# Altium schematic sheet SCH-HC15C_REV2_PG2.SchDoc: MODEL: HC 15C
size 863 x 558 mm; DocumentNumber: SCH-HC15C; SheetNumber: 2; SheetTotal: 3; Title2: HAB'S 1ST GEN CALCULATOR
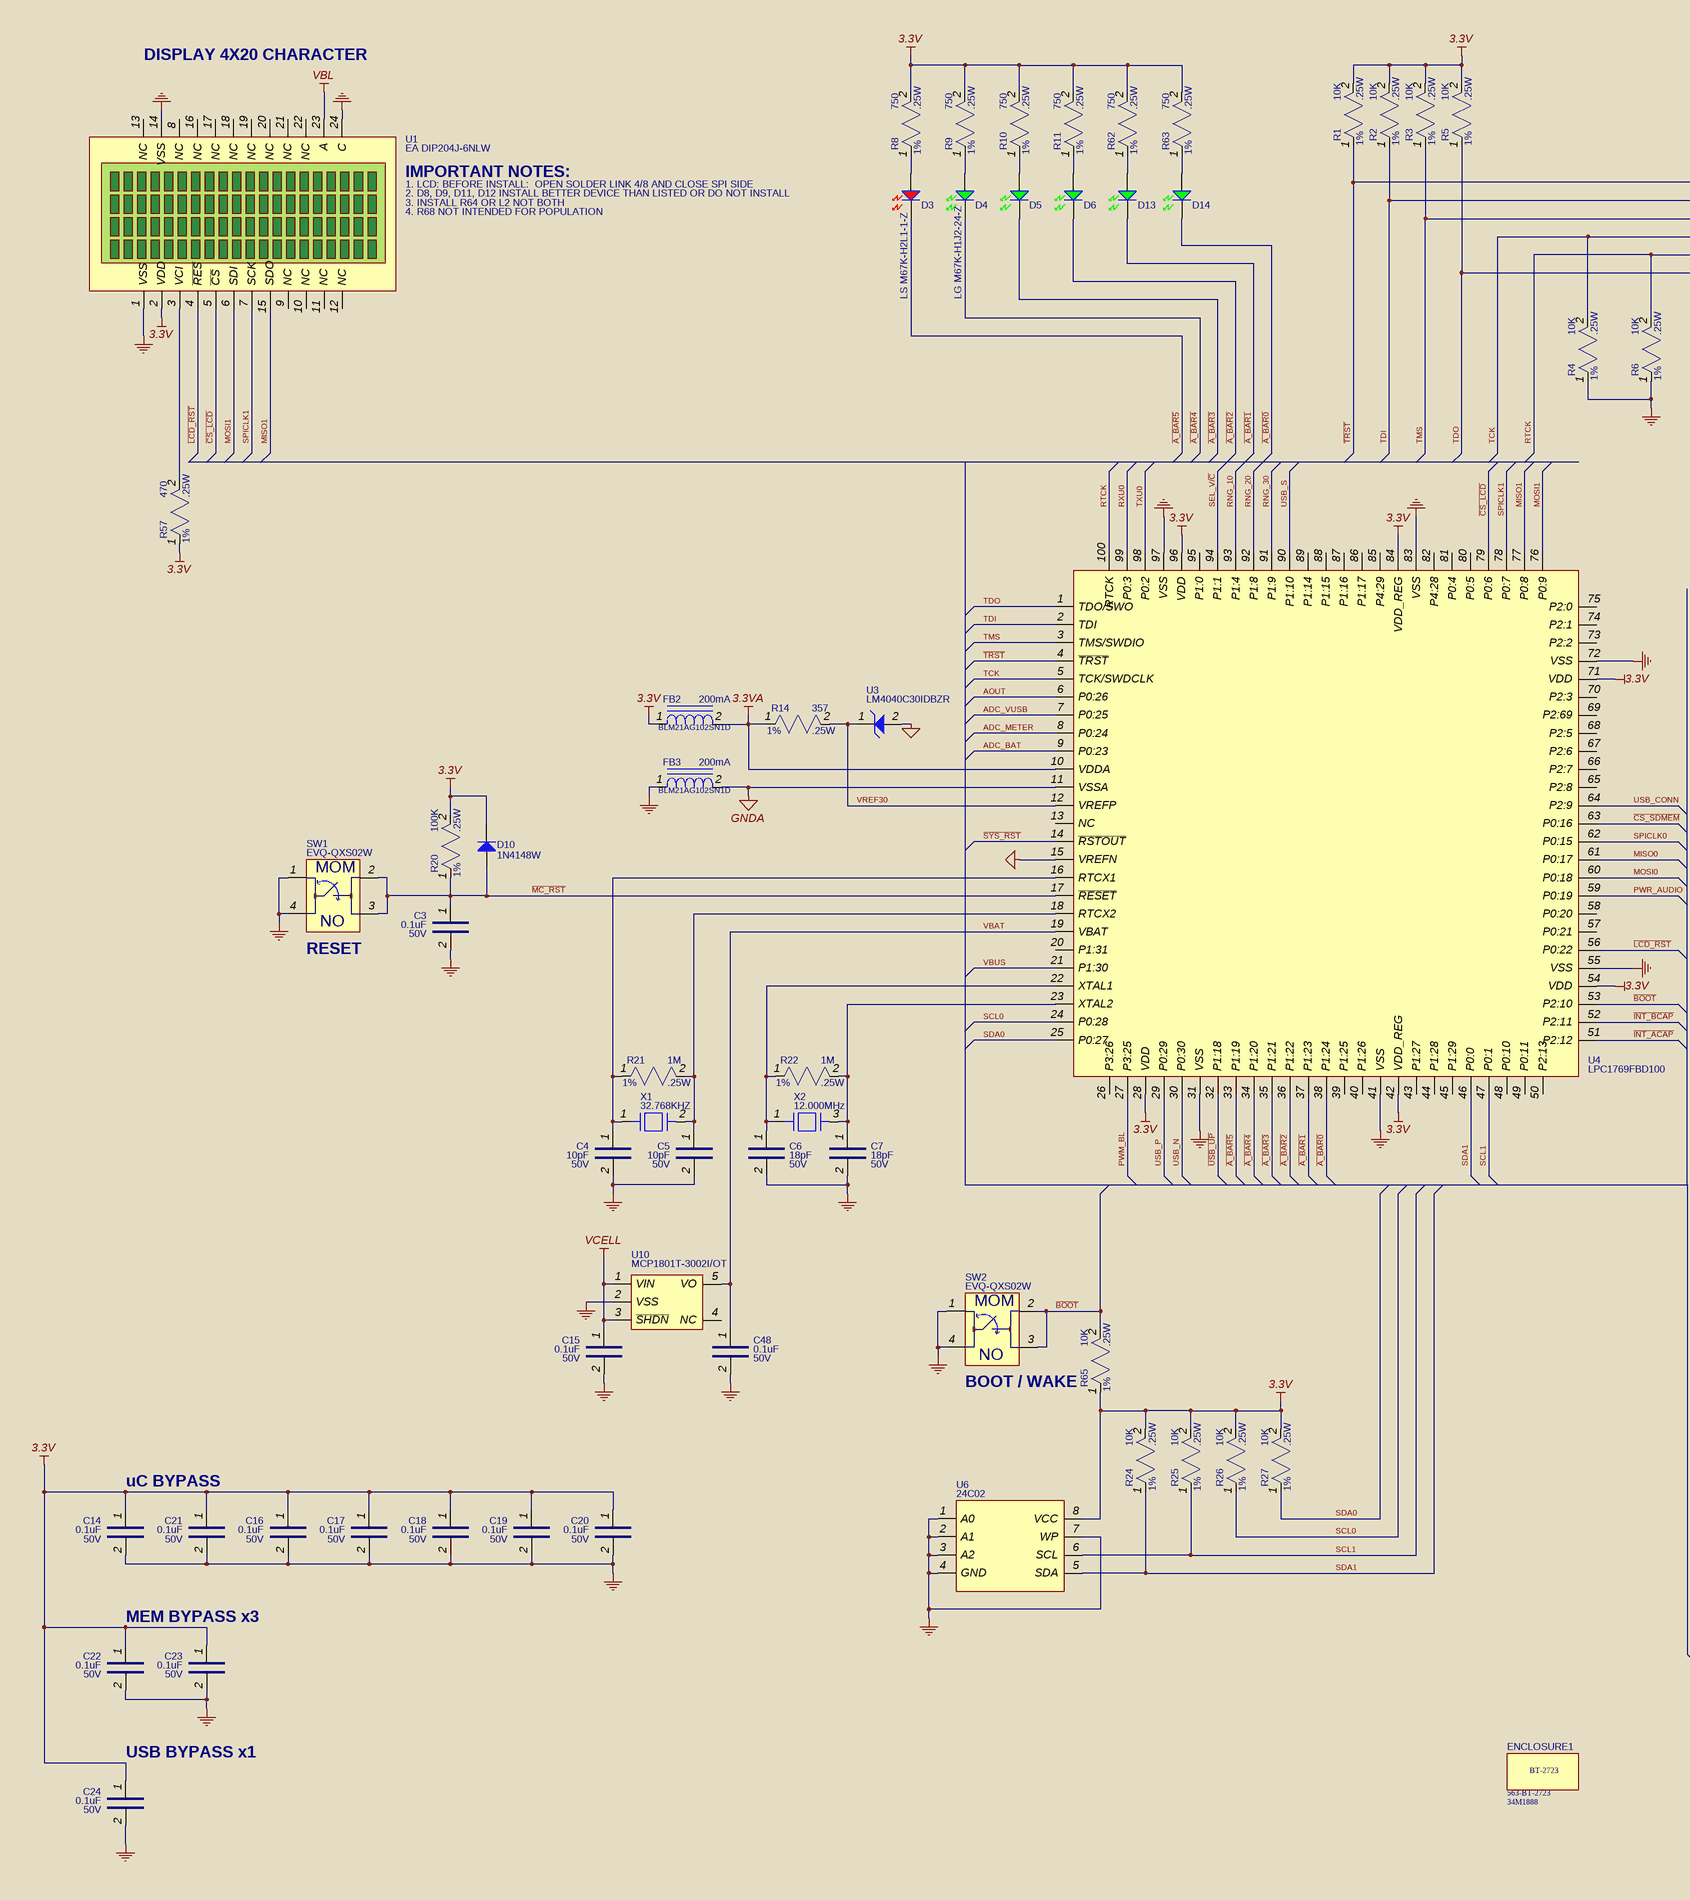
[diagram p0: SCH-HC15C_REV2_PG2.SchDoc, left]
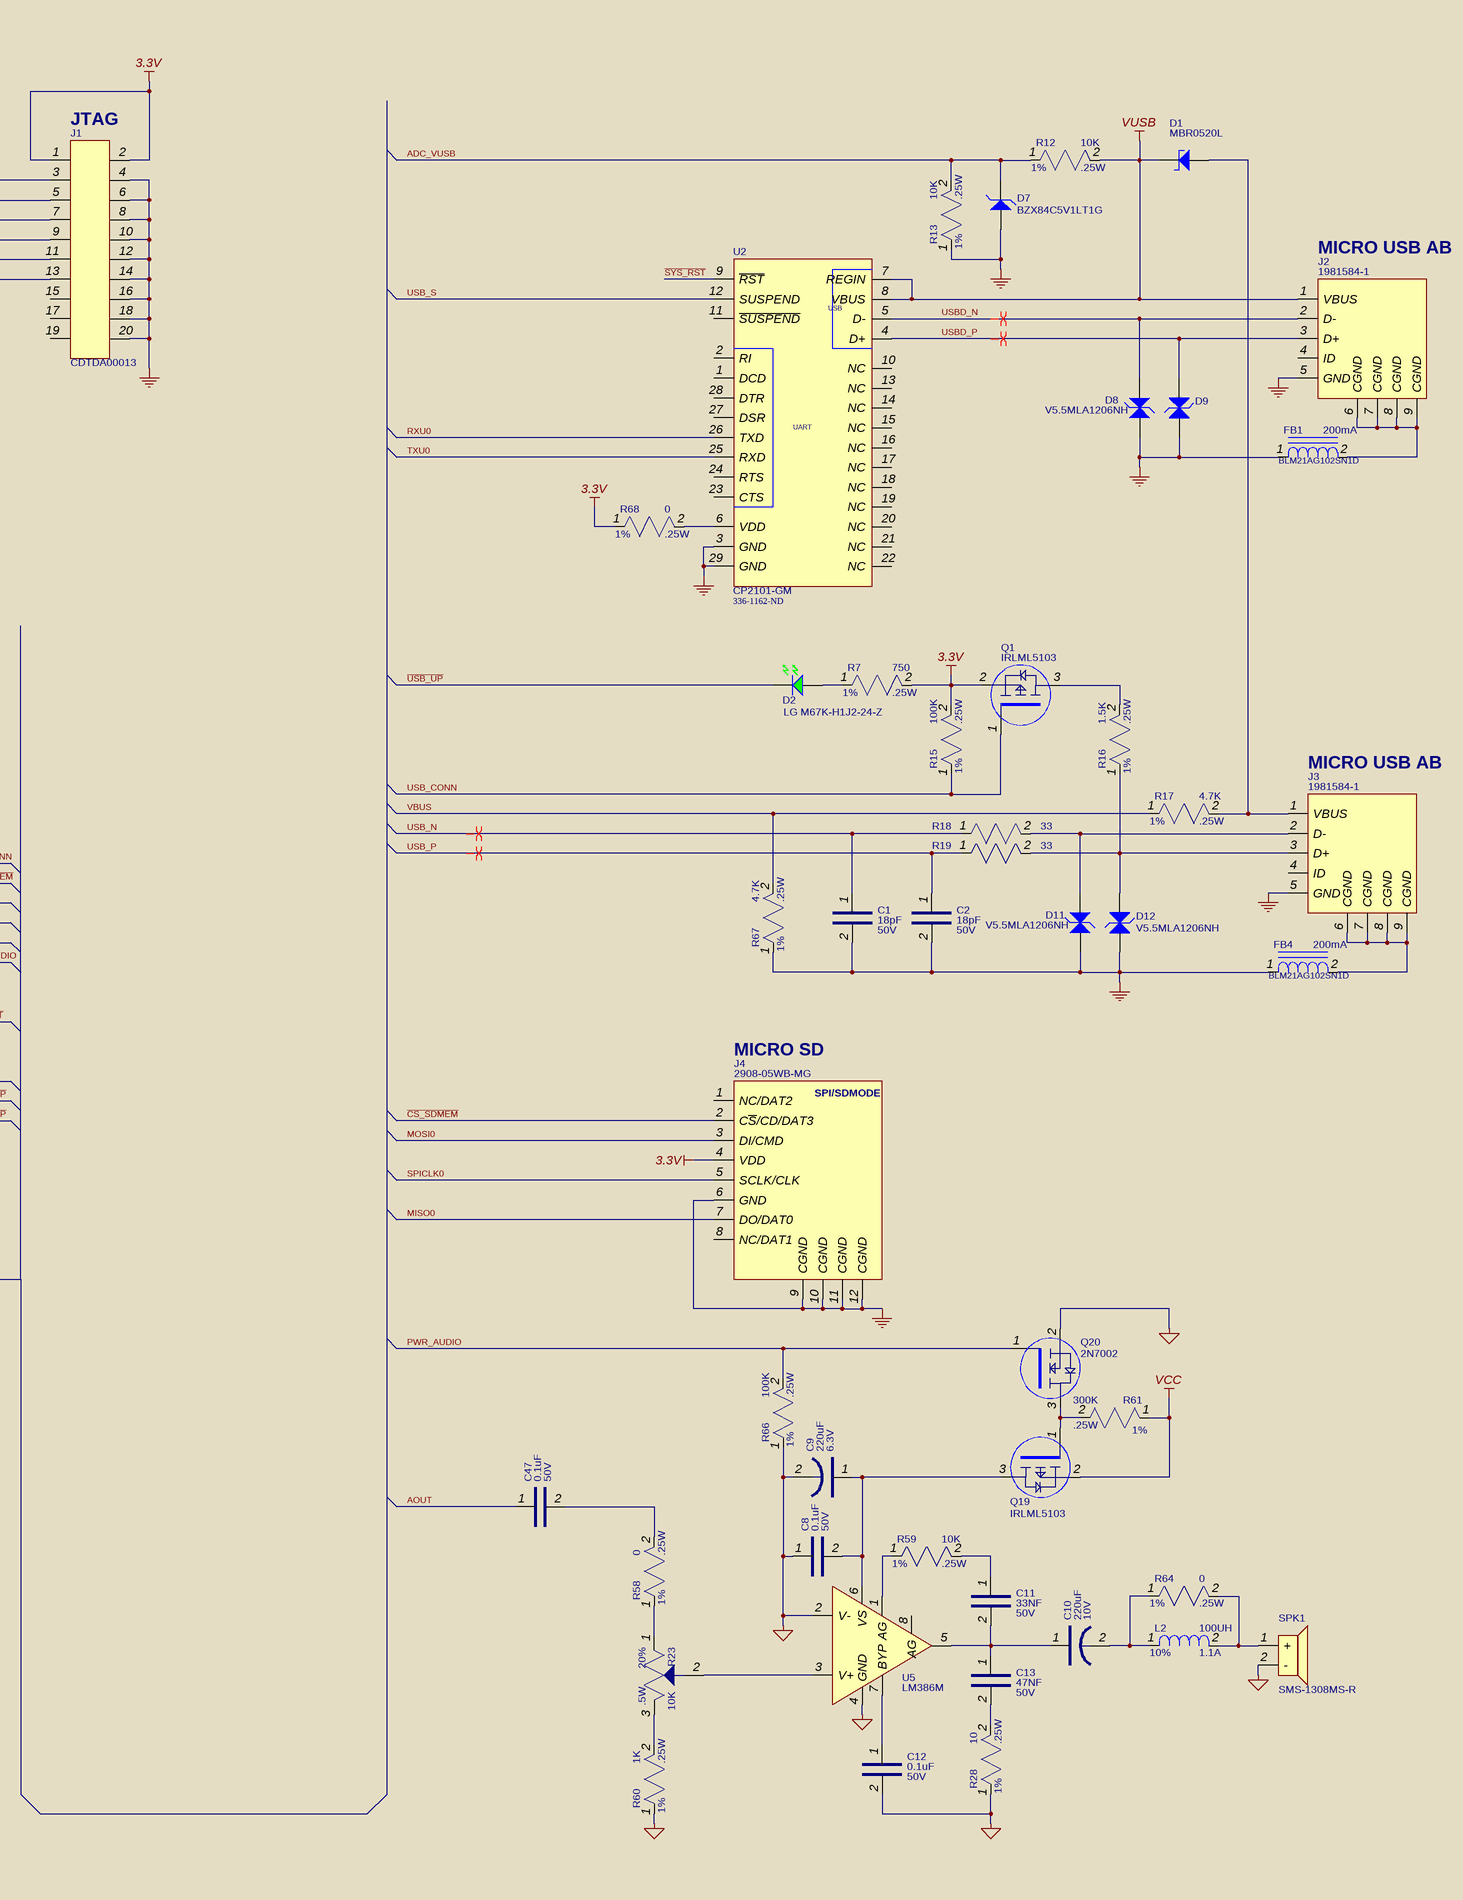
[diagram p1: SCH-HC15C_REV2_PG2.SchDoc, right]

## Parts
C1  value 18pF  VOLTAGE: 50V  [3216[1206] - TAN COLOR]  (hidden comment: CDECA00095)
C2  value 18pF  VOLTAGE: 50V  [3216[1206] - TAN COLOR]  (hidden comment: CDECA00095)
C3  value 0.1uF  VOLTAGE: 50V  [3216[1206] - TAN COLOR]  (hidden comment: CDECA00070)
C4  value 10pF  VOLTAGE: 50V  [3216[1206] - TAN COLOR]  (hidden comment: CDECA00143)
C5  value 10pF  VOLTAGE: 50V  [3216[1206] - TAN COLOR]  (hidden comment: CDECA00143)
C6  value 18pF  VOLTAGE: 50V  [3216[1206] - TAN COLOR]  (hidden comment: CDECA00095)
C7  value 18pF  VOLTAGE: 50V  [3216[1206] - TAN COLOR]  (hidden comment: CDECA00095)
C8  value 0.1uF  VOLTAGE: 50V  [3216[1206] - TAN COLOR]  (hidden comment: CDECA00070)
C9  value 220uF  VOLTAGE: 6.3V  [CAP_TANT_3528]  (hidden comment: CDECA00139_2)
C10  value 220uF  VOLTAGE: 10V  [CAP_ALE_WX-8mm]  (hidden comment: CDECA00110_2)
C11  value 33NF  VOLTAGE: 50V  [3216[1206] - TAN COLOR]  (hidden comment: CDECA00143_3)
C12  value 0.1uF  VOLTAGE: 50V  [3216[1206] - TAN COLOR]  (hidden comment: CDECA00070)
C13  value 47NF  VOLTAGE: 50V  [3216[1206] - TAN COLOR]  (hidden comment: CDECA00143_2)
C14  value 0.1uF  VOLTAGE: 50V  [3216[1206] - TAN COLOR]  (hidden comment: CDECA00070)
C15  value 0.1uF  VOLTAGE: 50V  [3216[1206] - TAN COLOR]  (hidden comment: CDECA00070)
C16  value 0.1uF  VOLTAGE: 50V  [3216[1206] - TAN COLOR]  (hidden comment: CDECA00070)
C17  value 0.1uF  VOLTAGE: 50V  [3216[1206] - TAN COLOR]  (hidden comment: CDECA00070)
C18  value 0.1uF  VOLTAGE: 50V  [3216[1206] - TAN COLOR]  (hidden comment: CDECA00070)
C19  value 0.1uF  VOLTAGE: 50V  [3216[1206] - TAN COLOR]  (hidden comment: CDECA00070)
C20  value 0.1uF  VOLTAGE: 50V  [3216[1206] - TAN COLOR]  (hidden comment: CDECA00070)
C21  value 0.1uF  VOLTAGE: 50V  [3216[1206] - TAN COLOR]  (hidden comment: CDECA00070)
C22  value 0.1uF  VOLTAGE: 50V  [3216[1206] - TAN COLOR]  (hidden comment: CDECA00070)
C23  value 0.1uF  VOLTAGE: 50V  [3216[1206] - TAN COLOR]  (hidden comment: CDECA00070)
C24  value 0.1uF  VOLTAGE: 50V  [3216[1206] - TAN COLOR]  (hidden comment: CDECA00070)
C47  value 0.1uF  VOLTAGE: 50V  [3216[1206] - TAN COLOR]  (hidden comment: CDECA00070)
C48  value 0.1uF  VOLTAGE: 50V  [3216[1206] - TAN COLOR]  (hidden comment: CDECA00070)
D1  value MBR0520L  [SOD123]  (hidden comment: CDEDA00019_1)
D2  value LG M67K-H1J2-24-Z  [OSRAM_XX_M67K]  (hidden comment: CDELA00016_1)
D3  value LS M67K-H2L1-1-Z  [OSRAM_XX_M67K]  (hidden comment: CDELA00015_1)
D4  value LG M67K-H1J2-24-Z  [OSRAM_XX_M67K]  (hidden comment: CDELA00016_1)
D5  CDELA00016_1  [OSRAM_XX_M67K]  (value not drawn)
D6  CDELA00016_1  [OSRAM_XX_M67K]  (value not drawn)
D7  value BZX84C5V1LT1G  [SOT23 - TRANSISTOR]  (hidden comment: CDEDA00043)
D8  value V5.5MLA1206NH  [3216[1206]]  (hidden comment: CDEDA00037_1)
D9  CDEDA00037_1  [3216[1206]]  (value not drawn)
D10  value 1N4148W  [SOD123]  (hidden comment: CDEDA00020)
D11  value V5.5MLA1206NH  [3216[1206]]  (hidden comment: CDEDA00037_1)
D12  value V5.5MLA1206NH  [3216[1206]]  (hidden comment: CDEDA00037_1)
D13  CDELA00016_1  [OSRAM_XX_M67K]  (value not drawn)
D14  CDELA00016_1  [OSRAM_XX_M67K]  (value not drawn)
ENCLOSURE1  Supplier Part Number 1: 563-BT-2723  Supplier Part Number 2: 34M1888  [BT-2723]  (hidden comment: CDEVA_3)  (no BOM)
FB1  MFG_PN: BLM21AG102SN1D  POWER: 200mA  [2012[0805]]  (hidden comment: CDEVA00115)
FB2  MFG_PN: BLM21AG102SN1D  POWER: 200mA  [2012[0805]]  (hidden comment: CDEVA00115)
FB3  MFG_PN: BLM21AG102SN1D  POWER: 200mA  [2012[0805]]  (hidden comment: CDEVA00115)
FB4  MFG_PN: BLM21AG102SN1D  POWER: 200mA  [2012[0805]]  (hidden comment: CDEVA00115)
J1  CDTDA00013  [HDR_2X10_100MIL]
J2  value 1981584-1  [TYCO_1981584-1_REV2]  (hidden comment: CDTDA_1)
J3  value 1981584-1  [TYCO_1981584-1_REV2]  (hidden comment: CDTDA_1)
J4  value 2908-05WB-MG  [3M_2908-05WB-MG]  (hidden comment: CDTDA_2)
L2  value 100UH  TOLERANCE: 10%  POWER: 1.1A  [BOURNS_SDR0805-XXXX]  (hidden comment: CDEHA00005_2)
Q1  value IRLML5103  [SOT23 - TRANSISTOR]  (hidden comment: CDENA00031)
Q19  value IRLML5103  [SOT23 - TRANSISTOR]  (hidden comment: CDENA00031)
Q20  value 2N7002  [SOT23 - TRANSISTOR]  (hidden comment: CDENA00030)
R1  value 10K  TOLERANCE: 1%  POWER: .25W  [3216[1206]]  (hidden comment: CDERA00170)
R2  value 10K  TOLERANCE: 1%  POWER: .25W  [3216[1206]]  (hidden comment: CDERA00170)
R3  value 10K  TOLERANCE: 1%  POWER: .25W  [3216[1206]]  (hidden comment: CDERA00170)
R4  value 10K  TOLERANCE: 1%  POWER: .25W  [3216[1206]]  (hidden comment: CDERA00170)
R5  value 10K  TOLERANCE: 1%  POWER: .25W  [3216[1206]]  (hidden comment: CDERA00170)
R6  value 10K  TOLERANCE: 1%  POWER: .25W  [3216[1206]]  (hidden comment: CDERA00170)
R7  value 750  TOLERANCE: 1%  POWER: .25W  [3216[1206]]  (hidden comment: CDERA00276_1)
R8  value 750  TOLERANCE: 1%  POWER: .25W  [3216[1206]]  (hidden comment: CDERA00276_1)
R9  value 750  TOLERANCE: 1%  POWER: .25W  [3216[1206]]  (hidden comment: CDERA00276_1)
R10  value 750  TOLERANCE: 1%  POWER: .25W  [3216[1206]]  (hidden comment: CDERA00276_1)
R11  value 750  TOLERANCE: 1%  POWER: .25W  [3216[1206]]  (hidden comment: CDERA00276_1)
R12  value 10K  TOLERANCE: 1%  POWER: .25W  [3216[1206]]  (hidden comment: CDERA00170)
R13  value 10K  TOLERANCE: 1%  POWER: .25W  [3216[1206]]  (hidden comment: CDERA00170)
R14  value 357  TOLERANCE: 1%  POWER: .25W  [3216[1206]]  (hidden comment: CDERA00275_6)
R15  value 100K  TOLERANCE: 1%  POWER: .25W  [3216[1206]]  (hidden comment: CDERA00198)
R16  value 1.5K  TOLERANCE: 1%  POWER: .25W  [3216[1206]]  (hidden comment: CDERA00179)
R17  value 4.7K  TOLERANCE: 1%  POWER: .25W  [3216[1206]]  (hidden comment: CDERA00169)
R18  value 33  [3216[1206]]  (hidden comment: CDERA00207)
R19  value 33  [3216[1206]]  (hidden comment: CDERA00207)
R20  value 100K  TOLERANCE: 1%  POWER: .25W  [3216[1206]]  (hidden comment: CDERA00198)
R21  value 1M  TOLERANCE: 1%  POWER: .25W  [3216[1206]]  (hidden comment: CDERA00191)
R22  value 1M  TOLERANCE: 1%  POWER: .25W  [3216[1206]]  (hidden comment: CDERA00191)
R23  value 10K  TOLERANCE: 20%  POWER: .5W  [BOURNS_3352]  (hidden comment: CDERA00207_2)
R24  value 10K  TOLERANCE: 1%  POWER: .25W  [3216[1206]]  (hidden comment: CDERA00170)
R25  value 10K  TOLERANCE: 1%  POWER: .25W  [3216[1206]]  (hidden comment: CDERA00170)
R26  value 10K  TOLERANCE: 1%  POWER: .25W  [3216[1206]]  (hidden comment: CDERA00170)
R27  value 10K  TOLERANCE: 1%  POWER: .25W  [3216[1206]]  (hidden comment: CDERA00170)
R28  value 10  TOLERANCE: 1%  POWER: .25W  [3216[1206]]  (hidden comment: CDERA00142)
R57  value 470  TOLERANCE: 1%  POWER: .25W  [3216[1206]]  (hidden comment: CDERA00153)
R58  value 0  TOLERANCE: 1%  POWER: .25W  [3216[1206]]  (hidden comment: CDERA00181)
R59  value 10K  TOLERANCE: 1%  POWER: .25W  [3216[1206]]  (hidden comment: CDERA00170)
R60  value 1K  TOLERANCE: 1%  POWER: .25W  [3216[1206]]  (hidden comment: CDERA00195)
R61  value 300K  TOLERANCE: 1%  POWER: .25W  [3216[1206]]  (hidden comment: CDERA00275_8)
R62  value 750  TOLERANCE: 1%  POWER: .25W  [3216[1206]]  (hidden comment: CDERA00276_1)
R63  value 750  TOLERANCE: 1%  POWER: .25W  [3216[1206]]  (hidden comment: CDERA00276_1)
R64  value 0  TOLERANCE: 1%  POWER: .25W  [3216[1206]]  (hidden comment: CDERA00181)
R65  value 10K  TOLERANCE: 1%  POWER: .25W  [3216[1206]]  (hidden comment: CDERA00170)
R66  value 100K  TOLERANCE: 1%  POWER: .25W  [3216[1206]]  (hidden comment: CDERA00198)
R67  value 4.7K  TOLERANCE: 1%  POWER: .25W  [3216[1206]]  (hidden comment: CDERA00169)
R68  value 0  TOLERANCE: 1%  POWER: .25W  [3216[1206]]  (hidden comment: CDERA00181)
SPK1  MFG_PN: SMS-1308MS-R  [PUI_AUDIO_SMS-1308MS-R]  (hidden comment: CDEVA_2)
SW1  value EVQ-QXS02W  [PANASONIC_EVQQX]  (hidden comment: CDESA00095)
SW2  value EVQ-QXS02W  [PANASONIC_EVQQX]  (hidden comment: CDESA00095)
U1  value EA DIP204J-6NLW  [EA_790-EADIP204J6NLW]  (hidden comment: CDELA00023_1)
U2  value CP2101-GM  Supplier Part Number 1: 336-1162-ND  [QFN50P500X500-28VBM-MODIFIED]  (hidden comment: CDEUA00070_1)
U3  value LM4040C30IDBZR  [SOT23 - TRANSISTOR]  (hidden comment: CDEUA00049)
U4  MFG_PN: LPC1769FBD100  [SQFP50P1600X1600-100M_MODIFIED]  (hidden comment: CDEUA00069_2)
U5  value LM386M  [S8_N: Linear Tech SO8 NARROW]  (hidden comment: CDEUA00071_1)
U6  value 24C02  [S8_N: Linear Tech SO8 NARROW]  (hidden comment: CDEUA00020)
U10  value MCP1801T-3002I/OT  [SOT23-5AN]  (hidden comment: CDEUA00071_2)
X1  value 32.768KHZ  [ABS10]  (hidden comment: CDEKA00015_1)
X2  value 12.000MHz  [TCX_7B]  (hidden comment: CDEKA00019_1)

## Nets
3.3V: C14.1 C16.1 C17.1 C18.1 C19.1 C20.1 C21.1 C22.1 C23.1 C24.1 D10.2(K) FB2.1 J1.1 J1.2 J4.4(VDD) Q1.2(E) R1.2 R2.2 R3.2 R5.2 R7.2 R8.2 R9.2 R10.2 R11.2 R15.2 R20.2 R24.2 R25.2 R26.2 R27.2 R57.1 R62.2 R63.2 R65.1 R68.1 U1.2(VDD) U4.28(VDD) U4.42(VDD_REG) U4.54(VDD) U4.71(VDD) U4.84(VDD_REG) U4.96(VDD) U6.8(VCC)
3.3VA: FB2.2 R14.1 U4.10(VDDA)
GND: C1.2 C2.2 C3.2 C4.2 C5.2 C6.2 C7.2 C14.2 C15.2 C16.2 C17.2 C18.2 C19.2 C20.2 C21.2 C22.2 C23.2 C24.2 C48.2 D7.1(A) D8.1(A) D9.1(A) D11.1(A) D12.1(A) FB1.1 FB3.1 FB4.1 J1.4 J1.6 J1.8 J1.10 J1.12 J1.14 J1.16 J1.18 J1.20 J2.5(GND) J3.5(GND) J4.6(GND) J4.9(CGND) J4.10(CGND) J4.11(CGND) J4.12(CGND) R4.1 R6.1 R13.1 R67.1 SW1.1 SW1.4 SW2.1 SW2.4 U1.1(VSS) U1.14(VSS) U1.24(C) U2.3(GND) U2.29(GND) U4.31(VSS) U4.41(VSS) U4.55(VSS) U4.72(VSS) U4.83(VSS) U4.97(VSS) U6.1(A0) U6.2(A1) U6.3(A2) U6.4(GND) U6.7(WP) U10.2(VSS) X2.2 X2.4
GNDA: C8.1 C9.2 C12.2 FB3.2 Q20.2(E) R28.1 R60.1 R66.1 SPK1.2(-) U3.2(A) U4.11(VSSA) U4.15(VREFN) U5.2(V-) U5.4(GND)
VBL: U1.23(A)
VCC: Q19.2(E) R61.1
VCELL: C15.1 U10.1(VIN) U10.3(~{SHDN})
VUSB: D1.2(K) J2.1(VBUS) R12.2 U2.7(REGIN) U2.8(VBUS)
~{A_BAR0}: D14.2(K) U4.38(P1:24)
~{A_BAR1}: D13.2(K) U4.37(P1:23)
~{A_BAR2}: D6.2(K) U4.36(P1:22)
~{A_BAR3}: D5.2(K) U4.35(P1:21)
~{A_BAR4}: D4.2(K) U4.34(P1:20)
~{A_BAR5}: D3.2(K) U4.33(P1:19)
~{BOOT}: R65.2 SW2.2 SW2.3 U4.53(P2:10)
~{CS_LCD}: U1.5(~{CS}) U4.79(P0:6)
~{CS_SDMEM}: J4.2(C~{S}/CD/DAT3) U4.63(P0:16)
~{INT_ACAP}: U4.51(P2:12)
~{INT_BCAP}: U4.52(P2:11)
~{LCD_RST}: U1.4(~{RES}) U4.56(P0:22)
~{MC_RST}: C3.1 D10.1(A) R20.1 SW1.2 SW1.3 U4.17(~{RESET})
~{SYS_RST}: U2.9(~{RST}) U4.14(~{RSTOUT})
~{TRST}: J1.3 R1.1 U4.4(~{TRST})
~{USB_UP}: D2.2(K) U4.32(P1:18)
ADC_BAT: U4.9(P0:23)
ADC_METER: U4.8(P0:24)
ADC_VUSB: D7.3(K) R12.1 R13.2 U4.7(P0:25)
AOUT: C47.1 U4.6(P0:26)
MISO0: J4.7(DO/DAT0) U4.61(P0:17)
MISO1: U1.15(SDO) U4.77(P0:8)
MOSI0: J4.3(DI/CMD) U4.60(P0:18)
MOSI1: U1.6(SDI) U4.76(P0:9)
PWM_BL: U4.27(P3:25)
PWR_AUDIO: Q20.1(B) R66.2 U4.59(P0:19)
RNG_10: U4.93(P1:4)
RNG_20: U4.92(P1:8)
RNG_30: U4.91(P1:9)
RTCK: J1.11 R6.2 U4.100(RTCK)
RXU0: U2.26(TXD) U4.99(P0:3)
SCL0: R26.1 U4.24(P0:28)
SCL1: R25.1 U4.47(P0:1) U6.6(SCL)
SDA0: R27.1 U4.25(P0:27)
SDA1: R24.1 U4.46(P0:0) U6.5(SDA)
SEL_V/~{C}: U4.94(P1:1)
SPICLK0: J4.5(SCLK/CLK) U4.62(P0:15)
SPICLK1: U1.7(SCK) U4.78(P0:7)
TCK: J1.9 R4.2 U4.5(TCK/SWDCLK)
TDI: J1.5 R2.1 U4.2(TDI)
TDO: J1.13 R5.1 U4.1(TDO/SWO)
TMS: J1.7 R3.1 U4.3(TMS/SWDIO)
TXU0: U2.25(RXD) U4.98(P0:2)
USB_CONN: Q1.1(B) R15.1 U4.64(P2:9)
USB_N: C1.1 R18.1 U4.30(P0:30)
USB_P: C2.1 R19.1 U4.29(P0:29)
USB_S: U2.12(SUSPEND) U4.90(P1:10)
USBD_N: D8.2(K) J2.2(D-) U2.5(D-)
USBD_P: D9.2(K) J2.3(D+) U2.4(D+)
VBAT: C48.1 U4.19(VBAT) U10.5(VO)
VBUS: R17.1 R67.2 U4.21(P1:30)
VREF30: R14.2 U3.1(K) U4.12(VREFP)
NetC4_1: C4.1 R21.1 U4.16(RTCX1) X1.1
NetC5_1: C5.1 R21.2 U4.18(RTCX2) X1.2
NetC6_1: C6.1 R22.1 U4.22(XTAL1) X2.1
NetC7_1: C7.1 R22.2 U4.23(XTAL2) X2.3
NetC8_2: C8.2 C9.1 Q19.3(C) U5.6(VS)
NetC10_1: C10.1 C11.2 C13.1 U5.5
NetC10_2: C10.2 L2.1 R64.1
NetC11_1: C11.1 R59.2
NetC12_1: C12.1 U5.7(BYP)
NetC13_2: C13.2 R28.2
NetC47_2: C47.2 R58.2
NetD1_1: D1.1(A) J3.1(VBUS) R17.2
NetD2_1: D2.1(A) R7.1
NetD3_1: D3.1(A) R8.1
NetD4_1: D4.1(A) R9.1
NetD5_1: D5.1(A) R10.1
NetD6_1: D6.1(A) R11.1
NetD11_2: D11.2(K) J3.2(D-) R18.2
NetD12_2: D12.2(K) J3.3(D+) R16.1 R19.2
NetD13_1: D13.1(A) R62.1
NetD14_1: D14.1(A) R63.1
NetFB1_2: FB1.2 J2.6(CGND) J2.7(CGND) J2.8(CGND) J2.9(CGND)
NetFB4_2: FB4.2 J3.6(CGND) J3.7(CGND) J3.8(CGND) J3.9(CGND)
NetL2_2: L2.2 R64.2 SPK1.1(+)
NetQ1_3: Q1.3(C) R16.2
NetQ19_1: Q19.1(B) Q20.3(C) R61.2
NetR23_1: R23.1 R58.1
NetR23_2: R23.2 U5.3(V+)
NetR23_3: R23.3 R60.2
NetR57_2: R57.2 U1.3(VCI)
NetR59_1: R59.1 U5.1(AG)
NetR68_2: R68.2 U2.6(VDD)

Not connected (* = marked no-connect by the designer): J1 15 17 19; J2 4(ID); J3 4(ID); J4 1(NC/DAT2) 8(NC/DAT1); U1 8(NC) 9(NC) 10(NC) 11(NC) 12(NC) 13(NC) 16(NC) 17(NC) 18(NC) 19(NC) 20(NC) 21(NC) 22(NC); U2 1(DCD) 2(RI) 10(NC) 11(~{SUSPEND}) 13(NC) 14(NC) 15(NC) 16(NC) 17(NC) 18(NC) 19(NC) 20(NC) 21(NC) 22(NC) 23(CTS) 24(RTS) 27(DSR) 28(DTR); U4 13(NC) 20(P1:31) 26(P3:26) 39(P1:25) 40(P1:26) 43(P1:27) 44(P1:28) 45(P1:29) 48(P0:10) 49(P0:11) 50(P2:13) 57(P0:21) 58(P0:20) 65(P2:8) 66(P2:7) 67(P2:6) 68(P2:5) 69(P2:69) 70(P2:3) 73(P2:2) 74(P2:1) 75(P2:0) 80(P0:5) 81(P0:4) 82(P4:28) 85(P4:29) 86(P1:17) 87(P1:16) 88(P1:15) 89(P1:14) 95(P1:0); U5 8(AG); U10 4(NC)

## Layout directives
differential pair: USB_N, USB_P, USBD_N, USBD_P

## Notes on the sheet
- DISPLAY 4X20 CHARACTER
- (near J1) JTAG
- IMPORTANT NOTES:
- 1. LCD: BEFORE INSTALL:  OPEN SOLDER LINK 4/8 AND CLOSE SPI SIDE
- 2. D8, D9, D11, D12 INSTALL BETTER DEVICE THAN LISTED OR DO NOT INSTALL
- 3. INSTALL R64 OR L2 NOT BOTH
- 4. R68 NOT INTENDED FOR POPULATION
- MICRO USB AB
- (near SW1) RESET
- MICRO SD
- (near SW2) BOOT / WAKE
- uC BYPASS
- MEM BYPASS x3
- USB BYPASS x1
- TITLE:
- SHEET:
- OF
- SCHEMATIC
- DRAWING #:
- 3621 GIN WAY
- SNELLVILLE, GA 30039
- INFORMATION CONTAINED HEREIN IS THE PROPERTY OF SYNERGY
- LIGHTING CONTROLS AND IS TO BE HELD IN COMPLETE CONFIDENCE.
- PHONE: 678-687-0270
- FILENAME:
- FILETYPE:
- REPRODUCE WITH WRITTEN CONSENT ONLY.
- ALTIUM
- (in symbol CDESA00095) MOM; NO
- (in symbol CDEUA00070_1) USB; UART
- (in symbol CDTDA_2) SPI/SDMODE

## Library data of the parts
C1 C2 C6 C7 = CDECA00095: CAP, CERAMIC, NPO, 18PF, 50V, 1206, 5%, RoHS; MFG: YAGEO; MFG_PN: CC1206JRNPO9BN180; TOLERANCE: 10%; Supplier 1: Digi-Key; Supplier Part Number 1: 311-1152-1-ND
C3 C8 C12 C14-C24 C47 C48 = CDECA00070: CAP, CERAMIC CHIP 0.1UF 10% 50V X7R ROHS; MFG: AVX; MFG_PN: 12065C104KAT2A; TOLERANCE: 10%; Supplier 1: Digi-Key; Supplier Part Number 1: 478-1556-1-ND
C4 C5 = CDECA00143: CAP, CERAMIC, NPO, 10PF, 50V, 1206, 5%, RoHS; MFG: AVX; MFG_PN: 12065A100DAT2A; TOLERANCE: 10%; Supplier 1: Digi-Key; Supplier Part Number 1: 478-5053-1-ND
C9 = CDECA00139_2: CAP, TANT, 220UF, 6.3V, 20%, LOW ESR, 3528, ROHS; MFG: KEMET; MFG_PN: T520B227M006ATE070; TOLERANCE: 20%; Supplier 1: Digi-Key; Supplier Part Number 1: 399-5756-1-ND
C10 = CDECA00110_2: CAP, ALE, 220UF, 10V, 20%, SM ROHS; MFG: NICHICON; MFG_PN: UWX1A221MCL1GB; TOLERANCE: 20%; Supplier 1: Digi-Key; Supplier Part Number 1: 493-2098-1-ND
C11 = CDECA00143_3: CAP, CERAMIC, X7R, 33NF, 50V, 1206, 10%, RoHS; MFG: YAGEO; MFG_PN: CC1206KRX7R9BB333; TOLERANCE: 10%; Supplier 1: Digi-Key; Supplier Part Number 1: 311-1177-1-ND
C13 = CDECA00143_2: CAP, CERAMIC, X7R, 47NF, 50V, 1206, 10%, RoHS; MFG: YAGEO; MFG_PN: CC1206KRX7R9BB473; TOLERANCE: 10%; Supplier 1: Digi-Key; Supplier Part Number 1: 311-1178-1-ND
D1 = CDEDA00019_1: Diode, Schottky rectifier, 20V, 0.5A, SOD-123 package, Pb free; MFG: FAIRCHILD SEMI; MFG_PN: MBR0520L; Supplier 1: Digi-Key; Supplier Part Number 1: MBR0520LCT-ND
D2 D4 = CDELA00016_1: DIODE,LED GREEN 0805 SMD; MFG: OSRAM; Supplier 1: Digi-Key; Supplier Part Number 1: 475-2730-1-ND; MFG_PN: LG M67K-H1J2-24-Z
D3 = CDELA00015_1: DIODE,LED RED 0805 SMD; MFG: OSRAM; Supplier 1: Digi-Key; Supplier Part Number 1: 475-2510-1-ND; MFG_PN: LS M67K-H2L1-1-Z
D5 D6 D13 D14 = CDELA00016_1: DIODE,LED GREEN 0805 SMD; MFG: OSRAM; MFG_PN: LG M67K-H1J2-24-Z; VALUE: LG M67K-H1J2-24-Z; Supplier 1: Digi-Key; Supplier Part Number 1: 475-2730-1-ND
D7 = CDEDA00043: DIODE, ZENER, 5.1V, 225MW, SOT-23, ROHS; MFG: ON SEMICONDUCTOR; Published: 8-Jun-2000; LatestRevisionDate: 17-Jul-2002; LatestRevisionNote: Re-released for DXP Platform.; DatasheetDocument: 1997; PackageReference: DO-35; Publisher: Altium Limited; Code_JEDEC: DO-204-AH; ComponentLink1Description: Manufacturer Link; ComponentLink2Description: Datasheet; MFG_PN: BZX84C5V1LT1G; Supplier 1: Digi-Key; Supplier Part Number 1: BZX84C5V1LT1GOSCT-ND
D8 D11 D12 = CDEDA00037_1: VARISTOR, TVS, 5.5VDC, 1206, 150A, .60J, RoHS; Manufacturer: Littelfuse Inc; MFG: LITTLEFUSE; Varistor Voltage: 9.3V; Number of Circuits: 1; Maximum AC Volts: 4VAC; Energy: 0.40J; MFG_PN: V5.5MLA1206NH; Supplier 1: Digi-Key; Manufacturer Part Number: V5.5MLA1206NH; RoHS: RoHS Compliant; Category: Circuit Protection; Stock 1: 17500; Pricing 1: 2500=0.437, 5000=0.415, 10000=0.398, 25000=0.387 (USD); Current-Surge: 150A; Maximum DC Volts: 5.5VDC; Package / Case: 1206 (3216 Metric); ComponentLink1URL: http://www.littelfuse.com/data/en/Data_Sheets/Littelfuse_MLV_MLA.pdf; ComponentLink1Description: http://www.littelfuse.com/data/en/Data_Sheets/Littelfuse_MLV_MLA.pdf; Supplier Part Number 1: F2219TR-ND
D9 = CDEDA00037_1: VARISTOR, TVS, 5.5VDC, 1206, 150A, .60J, RoHS; Manufacturer: Littelfuse Inc; MFG: LITTLEFUSE; MFG_PN: V5.5MLA1206NH; Varistor Voltage: 9.3V; Number of Circuits: 1; Maximum AC Volts: 4VAC; Energy: 0.40J; VALUE: V5.5MLA1206NH; Supplier 1: Digi-Key; Manufacturer Part Number: V5.5MLA1206NH; RoHS: RoHS Compliant; Category: Circuit Protection; Stock 1: 17500; Pricing 1: 2500=0.437, 5000=0.415, 10000=0.398, 25000=0.387 (USD); Current-Surge: 150A; Maximum DC Volts: 5.5VDC; Package / Case: 1206 (3216 Metric); ComponentLink1URL: http://www.littelfuse.com/data/en/Data_Sheets/Littelfuse_MLV_MLA.pdf; ComponentLink1Description: http://www.littelfuse.com/data/en/Data_Sheets/Littelfuse_MLV_MLA.pdf; Supplier Part Number 1: F2219TR-ND
D10 = CDEDA00020: DIODE, 150MA, 100V, SOD123; MFG: DIODES INC; MFG_PN: 1N4148W-7-F; Published: 8-Jun-2000; LatestRevisionDate: 17-Jul-2002; LatestRevisionNote: Re-released for DXP Platform.; DatasheetDocument: 1997; PackageReference: DO-35; Publisher: Altium Limited; Code_JEDEC: DO-204-AH; ComponentLink1Description: Manufacturer Link; ComponentLink1URL: http://www.fairchildsemi.com/; ComponentLink2Description: Datasheet; ComponentLink2URL: http://www.fairchildsemi.com/ds/1N%2F1N4148.pdf; Supplier 1: Digi-Key; Supplier 2: Digi-Key; Supplier Part Number 1: 1N4148W-FDICT-ND; Supplier Part Number 2: 1N4148WTPMSDKR-ND
ENCLOSURE1 = CDEVA_3: ENCLOSURE, PLASTIC, BUD INDUSTRIES BT-2723; MEGGITT PN: 104526; Supplier 1: Mouser; Supplier 2: Newark; Manufacturer: BUD INDUSTRIES; Manufacturer Part Number: BT-2723; APPROVED BY: *; CREATED BY: HSC
FB1-FB4 = CDEVA00115: FERRITE, 1KOHM AT 100MHZ, 220MA, .450DCR; MFG: MURATA; VALUE: 1K AT 100MHZ; TOLERANCE: 10%; Published: 8-Jun-2000; LatestRevisionDate: 04-Mar-2005; LatestRevisionNote: PCB Footprint replaced.; PackageReference: J1-0603; Publisher: Altium Limited; Supplier 1: Digi-Key; Supplier Part Number 1: 490-1041-1-ND
J1 = CDTDA00013: CONN, HDR, 2X10, 100MIL, TH, ROHS; MFG: TYCO ELECTRONICS; MFG_PN: 5103309-5; Supplier 1: Digi-Key; Supplier 2: Digi-Key; Supplier Part Number 1: A33166-ND; Supplier Part Number 2: MHB20K-ND
J2 J3 = CDTDA_1: CONN, RCPTL MICRO USB TYPE AB, SM RA; MFG: TYCO; MFG_PN: 1981584-1; Supplier 1: Digi-Key; Supplier Part Number 1: A97799CT-ND
J4 = CDTDA_2: CONN, MICRO SD, SM, ROHS; MFG: 3M; MFG_PN: 2908-05WB-MG; Supplier 1: Digi-Key; Supplier Part Number 1: 3M5607CT-ND
L2 = CDEHA00005_2: INDUCTOR, 100UH, 10%, SMT, NON-SHIELDED, FERRITE CORE, ROHS; MFG_PN: SDR0805-101KL; MFG: BOURNS; Supplier 1: Digi-Key; Supplier Part Number 1: SDR0805-101KLCT-ND
Q1 Q19 = CDENA00031: MOSFET P CHN, VDS=30V, RDSON = .6OHM, SOT 23; MFG: INTERNATIONAL RECTIFIER; Published: 8-Jun-2000; LatestRevisionDate: 15-Jan-2003; LatestRevisionNote: PCB Footprint 'BCY-W3/D4.7' replaced; DatasheetDocument: 1997; PackageDocument: Sep-1998; PackageReference: TO-92A; Publisher: Altium Limited; Code_JEDEC: TO-92A; ComponentLink1Description: Manufacturer Link; ComponentLink1URL: http://www.fairchildsemi.com/; ComponentLink2Description: Datasheet; ComponentLink2URL: http://www.fairchildsemi.com/ds/2N%2F2N3904.pdf; Supplier 1: Digi-Key; Supplier 3: Digi-Key; MFG_PN: IRLML5103; Supplier 4: Digi-Key; Supplier Part Number 1: IRLML5103PBFCT-ND
Q20 = CDENA00030: MOSFET N CHN, VDS=60V, 115 mA, SOT 23; MFG_PN: 2N7002-7-F; MFG: DIODES INC; Published: 8-Jun-2000; LatestRevisionDate: 15-Jan-2003; LatestRevisionNote: PCB Footprint 'BCY-W3/D4.7' replaced; DatasheetDocument: 1997; PackageDocument: Sep-1998; PackageReference: TO-92A; Publisher: Altium Limited; Code_JEDEC: TO-92A; ComponentLink1Description: Manufacturer Link; ComponentLink1URL: http://www.fairchildsemi.com/; ComponentLink2Description: Datasheet; ComponentLink2URL: http://www.fairchildsemi.com/ds/2N%2F2N3904.pdf; Supplier 3: Digi-Key; Supplier 4: Digi-Key; Supplier 1: Digi-Key; Supplier Part Number 1: 2N7002-FDICT-ND
R1-R6 R12 R13 R24-R27 R59 R65 = CDERA00170: RESISTOR, CHIP 1206 10K OHM 1% 1/4W THICK FILM ROHS; MFG: PANASONIC; MFG_PN: ERJ-8GEYJ103V; Published: 8-Jun-2000; LatestRevisionDate: 04-Mar-2005; LatestRevisionNote: PCB Footprint replaced.; PackageReference: J1-0603; Publisher: Altium Limited; Supplier 1: Digi-Key; Supplier 2: Digi-Key; Supplier Part Number 1: P10KECT-ND; Supplier Part Number 2: 311-10KERCT-ND
R7-R11 R62 R63 = CDERA00276_1: RESISTOR, CHIP 1206 750 OHM 1% 1/4W THICK FILM ROHS; MFG: PANASONIC; MFG_PN: ERJ-8ENF7500V; Supplier 1: Digi-Key; Supplier Part Number 1: P750FCT-ND
R14 = CDERA00275_6: RESISTOR, CHIP 1206 357 OHM 1% 1/4W THICK FILM ROHS; MFG: PANASONIC; MFG_PN: ERJ-8ENF3570V; Published: 8-Jun-2000; LatestRevisionDate: 04-Mar-2005; LatestRevisionNote: PCB Footprint replaced.; PackageReference: J1-0603; Publisher: Altium Limited; Supplier 1: Digi-Key; Supplier Part Number 1: P357FCT-ND
R15 R20 R66 = CDERA00198: RESISTOR, CHIP 1206 100K OHM 1% 1/4W THICK FILM ROHS; MFG: PANASONIC; MFG_PN: ERJ-8ENF1003V; Published: 8-Jun-2000; LatestRevisionDate: 04-Mar-2005; LatestRevisionNote: PCB Footprint replaced.; PackageReference: J1-0603; Publisher: Altium Limited; Supplier 1: Digi-Key; Supplier Part Number 1: P100KFCT-ND
R16 = CDERA00179: RESISTOR, CHIP 1206 1.5K OHM 1% 1/4W THICK FILM ROHS; MFG: PANASONIC; MFG_PN: ERJ-8GEYJ152V; Published: 8-Jun-2000; LatestRevisionDate: 04-Mar-2005; LatestRevisionNote: PCB Footprint replaced.; PackageReference: J1-0603; Publisher: Altium Limited; Supplier 1: Digi-Key; Supplier 2: Digi-Key; Supplier Part Number 1: P1.5KECT-ND
R17 R67 = CDERA00169: RESISTOR, CHIP 1206 4.7K OHM 1% 1/4W THICK FILM ROHS; MFG: PANASONIC; MFG_PN: ERJ-8GEYJ472V; Published: 8-Jun-2000; LatestRevisionDate: 04-Mar-2005; LatestRevisionNote: PCB Footprint replaced.; PackageReference: J1-0603; Publisher: Altium Limited; Supplier 1: Digi-Key; Supplier Part Number 1: P4.7KECT-ND
R18 R19 = CDERA00207: RESISTOR, CHIP 1206 33 OHM 1% 1/4W THICK FILM ROHS; MFG: PANASONIC; MFG_PN: ERJ-8ENF33R0V; POWER: .25W; Supplier 1: Digi-Key; Supplier Part Number 1: P33.0FCT-ND; TOLERANCE: 1%
R21 R22 = CDERA00191: RESISTOR, CHIP 1206 1MOHM 1% 1/4W THICK FILM ROHS; MFG: PANASONIC; MFG_PN: ERJ-8GEYJ105V; Published: 8-Jun-2000; LatestRevisionDate: 04-Mar-2005; LatestRevisionNote: PCB Footprint replaced.; PackageReference: J1-0603; Publisher: Altium Limited; Supplier 1: Digi-Key; Supplier Part Number 1: P1.0MECT-ND
R23 = CDERA00207_2: RESISTOR, POT 10K OHM 20% THUMBWHELL, CERM, TH, ROHS; MFG: BOURNS; MFG_PN: 3352T-1-103LF; Supplier 1: Digi-Key; Supplier Part Number 1: 3352T-103LF-ND
R28 = CDERA00142: RESISTOR, CHIP 1206 10 OHM 1% 1/4W THICK FILM ROHS; MFG: PANASONIC; MFG_PN: ERJ-8ENF10R0V; Supplier 1: Digi-Key; Supplier Part Number 1: P10.0FCT-ND
R57 = CDERA00153: RESISTOR, CHIP 1206 470 OHM 1% 1/4W THICK FILM ROHS; MFG: PANASONIC; MFG_PN: ERJ-8ENF4700V; Published: 8-Jun-2000; LatestRevisionDate: 04-Mar-2005; LatestRevisionNote: PCB Footprint replaced.; PackageReference: J1-0603; Publisher: Altium Limited; Supplier 1: Digi-Key; Supplier Part Number 1: P470FTR-ND
R58 R64 R68 = CDERA00181: RESISTOR, CHIP 1206 0.0 OHM 1% 1/4W THICK FILM ROHS; MFG: PANASONIC; MFG_PN: ERJ-8GEYJ122V; Published: 8-Jun-2000; LatestRevisionDate: 04-Mar-2005; LatestRevisionNote: PCB Footprint replaced.; PackageReference: J1-0603; Publisher: Altium Limited; Supplier 1: Digi-Key; Supplier Part Number 1: P0.0ECT-ND
R60 = CDERA00195: RESISTOR, CHIP 1206 1K OHM 1% 1/4W THICK FILM ROHS; MFG: PANASONIC; MFG_PN: ERJ-8ENF1001V; Published: 8-Jun-2000; LatestRevisionDate: 04-Mar-2005; LatestRevisionNote: PCB Footprint replaced.; PackageReference: J1-0603; Publisher: Altium Limited; Supplier 1: Digi-Key; Supplier Part Number 1: P1.00KFCT-ND
R61 = CDERA00275_8: RESISTOR, CHIP 1206 300K OHM 1% 1/4W THICK FILM ROHS; MFG: PANASONIC; MFG_PN: ERJ-8ENF3003V; Published: 8-Jun-2000; LatestRevisionDate: 04-Mar-2005; LatestRevisionNote: PCB Footprint replaced.; PackageReference: J1-0603; Publisher: Altium Limited; Supplier 1: Digi-Key; Supplier Part Number 1: P300KFCT-ND
SPK1 = CDEVA_2: SPEAKER 8OHM .7W 88DB 13MM SMD; MFG: PUI AUDIO; Supplier 1: Digi-Key; Supplier Part Number 1: 668-1206-1-ND
SW1 SW2 = CDESA00095: SWITCH, MOM, NO, SM; MFG: PANASONIC; Published: 8-Jun-2000; LatestRevisionDate: 17-Jul-2002; LatestRevisionNote: Re-released for DXP Platform.; DatasheetDocument: 1997; PackageReference: DO-35; Publisher: Altium Limited; Code_JEDEC: DO-204-AH; ComponentLink1Description: Manufacturer Link; ComponentLink1URL: http://www.fairchildsemi.com/; ComponentLink2Description: Datasheet; ComponentLink2URL: http://www.fairchildsemi.com/ds/1N%2F1N4148.pdf; MFG_PN: EVQ-QXS02W; Supplier 1: Digi-Key; Supplier Part Number 1: P13612SCT-ND
U1 = CDELA00023_1: LCD, 4X20 WITH ICONS, SERIAL INTERFACE, 5X8DOT, WHITE BACKLIGHT; MFG: ELECTRONIC ASSEMBLY; MFG_PN: EA DIP204J-6NLW
U2 = CDEUA00070_1: IC, TXRX USB TO UART BRIDGE, ROHS, 28QFN; MFG: SILICON LABS; MFG_PN: CP2101-GM; Supplier 1: Digi-Key
U3 = CDEUA00049: IC, SHUNT VOLTAGE REFERENCE; MFG: TEXAS INSTRUMENTS; MFG_PN: LM4040C30IDBZR; Supplier 1: Digi-Key; Supplier Part Number 1: 296-20887-1-ND
U4 = CDEUA00069_2: IC, MICRO CONTROLLER, 512KB FLASH, 64K, ARM CORTEX M3, 100LQFP; MFG: NXP; Supplier 1: Digi-Key; Supplier Part Number 1: 568-4966-ND
U5 = CDEUA00071_1: IC AUDIO AMP, CLASS AB, 325mW, 8SOIC, ROHS; MFG: NATIONAL SEMICONDUCTOR; MFG_PN: LM386M-1/NOPB; Supplier 1: Digi-Key; Supplier Part Number 1: LM386M-1-ND
U6 = CDEUA00020: IC, EEPROM, I2C, 256x8, 8PIN SO8, ROHOS; MFG: ATMEL; MFG_PN: AT24C02N-10SU-2.7; Published: 8-Jun-2000; DatasheetDocument: 1997; Publisher: Altium Limited; Supplier 1: Digi-Key; Supplier Part Number 1: AT24C02N-10SU-2.7-ND
U10 = CDEUA00071_2: IC 3.0V LDO REGULATOR SOT-23-5, ROHS; MFG: MICROCHIP; MFG_PN: MCP1801T-3002I/OT; Supplier 1: Digi-Key; Supplier Part Number 1: MCP1801T-3002I/OTCT-ND
X1 = CDEKA00015_1: CRYSTAL, 32.768KHZ, 12.5PF, SMT SM; MFG: ABRACON CORP; MFG_PN: ABS10-32.768KHZ-T; TOLERANCE: 20ppm; Supplier 1: Digi-Key; Supplier Part Number 1: 535-9536-1-ND
X2 = CDEKA00019_1: CRYSTAL, 12.000MHZ, 18PF, SMT; MFG: TCX CORP; MFG_PN: 7B-12.000MAAJ-T; TOLERANCE: 30ppm; Supplier 1: Digi-Key; Supplier Part Number 1: 887-1099-1-ND